# EAGLE design 原理图 (EAGLE 6.4)
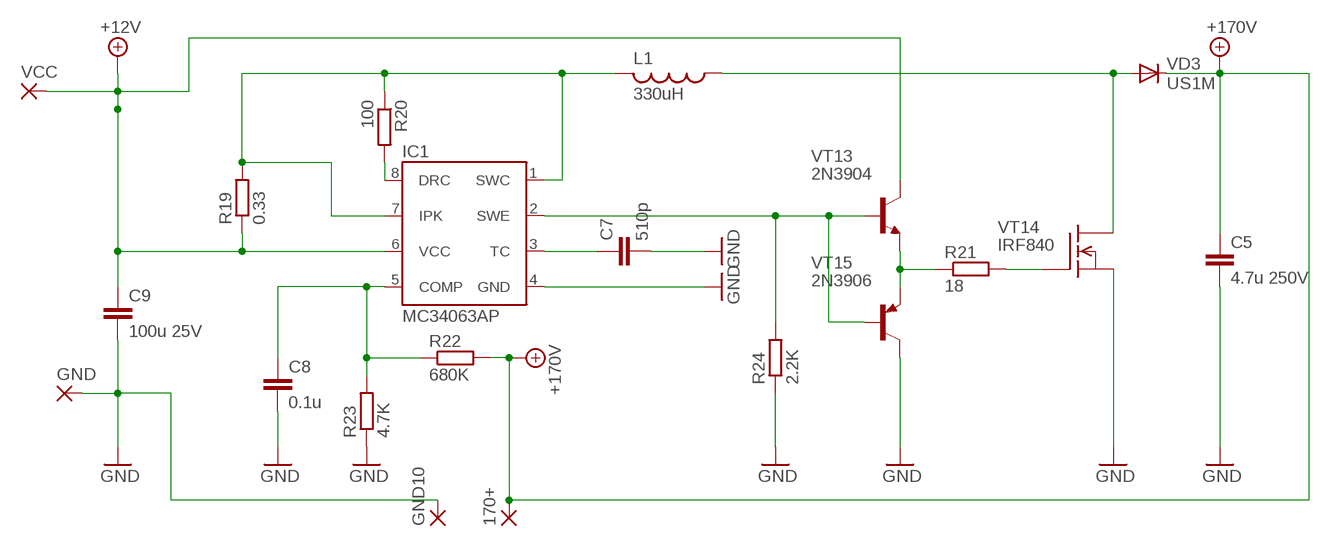
[diagram p0: schematic, sheet 1]

## Parts
170+  2,54/0,8  [2,54/0,8]
C5  4.7u 250V  C-EU025-030X050  [C025-030X050]
C7  510p  C-EU025-030X050  [C025-030X050]
C8  0.1u  C-EU025-030X050  [C025-030X050]
C9  100u 25V  C-EU025-030X050  [C025-030X050]
GND  2,54/0,8  [2,54/0,8]
GND10  2,54/0,8  [2,54/0,8]
IC1  MC34063AP  [DIL-08]
L1  330uH  L-US0204/5  [0204/5]
R19  0.33  R-EU_0204/5  [0204/5]
R20  100  R-EU_0204/5  [0204/5]
R21  18  R-EU_0204/5  [0204/5]
R22  680K  R-EU_0204/5  [0204/5]
R23  4.7K  R-EU_0204/5  [0204/5]
R24  2.2K  R-EU_0204/5  [0204/5]
VCC  2,54/0,8  [2,54/0,8]
VD3  US1M  1N4004  [DO41-10]
VT13  2N3904  [TO92]
VT14  IRF840  [TO220]
VT15  2N3906  [TO92]

## Nets
+12V: C9.1 IC1.6(VCC) R19.1 VCC.1(P) VT13.1(C)
+UB: 170+.1(P) C5.1 R22.2 VD3.C ; supply symbol labelled +170V
GND: C5.2 C7.2 C8.2 C9.2 GND10.1(P) GND.1(P) IC1.4(GND) R23.1 R24.1 VT14.3(S) VT15.1(C)
N$1: IC1.8(DRC) R20.2
N$2: C7.1 IC1.3(TC)
N$3: C8.1 IC1.5(COMP) R22.1 R23.2
N$4: L1.1 VD3.A VT14.2(D)
N$5: IC1.1(SWC) IC1.7(IPK) L1.2 R19.2 R20.1
N$6: IC1.2(SWE) R24.2 VT13.2(B) VT15.2(B)
N$7: R21.1 VT13.3(E) VT15.3(E)
N$8: R21.2 VT14.1(G)

## Library data of the parts
170+ GND GND10 VCC = wirepad:2,54/0,8: THROUGH-HOLE PAD
C5 C7-C9 = rcl:C-EU: CAPACITOR, European symbol
IC1 = v-reg-3:MC34063A: 1.5A Step-Up/Down/Inverting Switching Regulator NPN Darlington Switch, Vin 3V to 40V, Current Limiter Input, adjustable Frequency up to 100kHz
L1 = rcl:L-US: INDUCTOR, American symbol
R19-R24 = rcl:R-EU_: RESISTOR, European symbol
VD3 = diode:1N4004: DIODE general purpose rectifier, 1 A
VT13 = transistor:2N3904: NPN TRANSISTOR
VT14 = transistor-fet:IRF840: N-Channel Enhancement MOSFET (HEXFET); 500V; 8A; 0,85Ohm
VT15 = transistor-pnp:2N3906: PNP Transistor

## Board
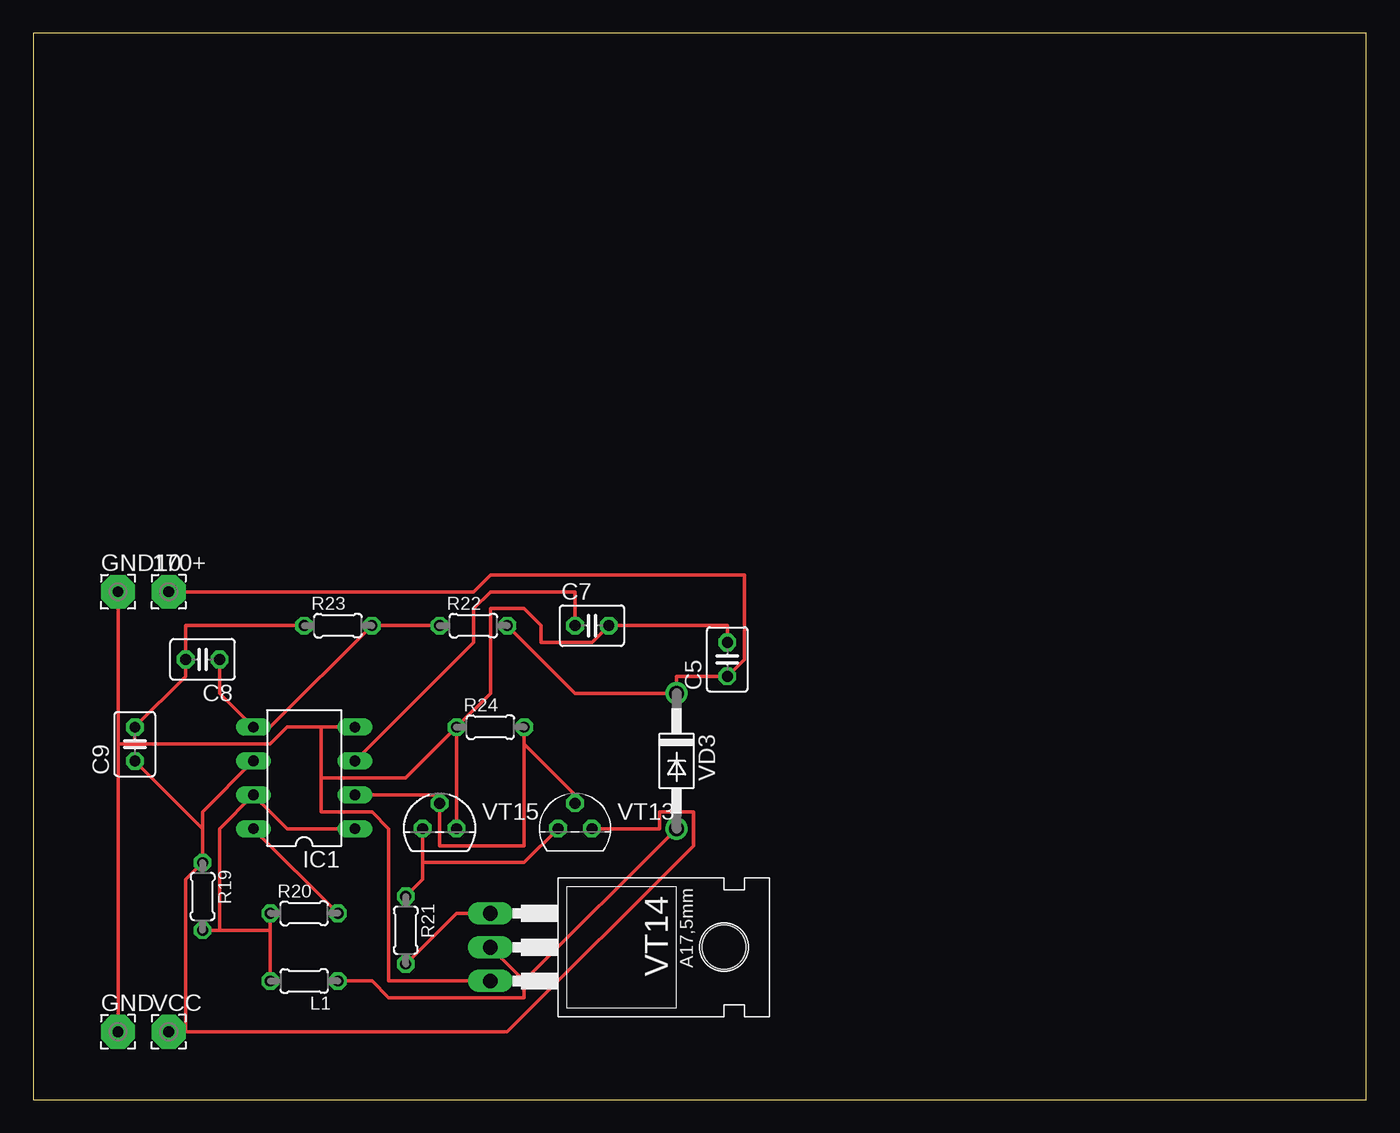
[diagram p1: board, top side]

Size 100 x 80 mm. Coordinates in mm from the lower left corner, seen from the top.
Outline: 0,0 100,0 100,80 0,80 0,0
Copper layers (1*16): Top 0.035mm / dielectric 1.5mm / Bottom 0.035mm
Design rules "default": minimum track width 10mil, minimum drill 24mil, track to track 8mil, track to pad 8mil, pad to pad 8mil, via to via 8mil, smd to smd 8mil, copper to edge 40mil, drill to drill 8mil, minimum pad ring 10mil, minimum via ring 8mil, stop-mask expansion 4mil, vias tented up to drill 0mil, thermal gap 10mil

### Footprints (pad centres in the part's own frame; a part is rotated, then mirrored left to right if it is on the bottom)
2,54/0,8 = drill 0.813 pad 2.54 octagon: 1 0,0
C025-030X050 = drill 0.813 octagon: 1 -1.27,0; 2 1.27,0
DIL-08 = drill 0.813 long: 1 -3.81,-3.81; 2 -1.27,-3.81; 3 1.27,-3.81; 4 3.81,-3.81; 5 3.81,3.81; 6 1.27,3.81; 7 -1.27,3.81; 8 -3.81,3.81
0204/5 = drill 0.813 octagon: 1 -2.54,0; 2 2.54,0
DO41-10 = drill 1.118: A 5.08,0; C -5.08,0
TO92 = drill 0.813 octagon: 1 1.27,0; 2 0,1.905; 3 -1.27,0
TO220 = drill 1.118 long: 1 -2.54,-6.35; 2 0,-6.35; 3 2.54,-6.35 | hole 3.302: 0,11.176

### Placement (x,y rotation side)
170+  10.16,38.1 0 top
C5  52.07,33.02 90 top
C7  41.91,35.56 0 top
C8  12.7,33.02 180 top
C9  7.62,26.67 90 top
GND  6.35,5.08 0 top
GND10  6.35,38.1 0 top
IC1  20.32,24.13 90 top
L1  20.32,8.89 180 top
R19  12.7,15.24 270 top
R20  20.32,13.97 0 top
R21  27.94,12.7 270 top
R22  33.02,35.56 0 top
R23  22.86,35.56 0 top
R24  34.29,27.94 0 top
VCC  10.16,5.08 0 top
VD3  48.26,25.4 270 top
VT13  40.64,20.32 0 top
VT14  40.64,11.43 270 top
VT15  30.48,20.32 0 top

### Tracks (layer width: path | path; a pad name or v marks a point on that pad's centre or on a via)
+12V
  Top 0.254: IC1.6 12.7,21.59 12.7,20.32 | 12.7,20.32 R19.1 11.43,16.51 11.43,5.08 | 12.7,20.32 C9.1 | VT13.1 46.99,20.32 46.99,21.59 49.53,21.59 49.53,19.05 35.56,5.08 11.43,5.08 | VCC.1 11.43,5.08
+UB
  Top 0.254: R22.2 40.64,30.48 VD3.C 48.26,31.75 C5.1 53.34,33.02 53.34,39.37 34.29,39.37 33.02,38.1 170+.1
GND
  Top 0.254: C5.2 52.07,35.56 C7.2 41.91,34.29 38.1,34.29 38.1,35.56 36.83,36.83 34.29,36.83 34.29,30.48 R24.1 | GND10.1 6.35,26.67 | 6.35,26.67 GND.1 | R24.1 VT15.1 | 21.59,27.94 19.05,27.94 17.78,26.67 7.62,26.67 | 21.59,27.94 IC1.4 | 7.62,26.67 C9.2 11.43,31.75 C8.2 11.43,35.56 R23.1 | VT14.3 26.67,8.89 26.67,20.32 25.4,21.59 21.59,21.59 21.59,24.13 | 21.59,27.94 21.59,24.13 | R24.1 27.94,24.13 21.59,24.13 | 7.62,26.67 6.35,26.67
N$1
  Top 0.254: R20.2 IC1.8
N$2
  Top 0.254: IC1.3 33.02,34.29 33.02,36.83 34.29,38.1 40.64,38.1 C7.1
N$3
  Top 0.254: R22.1 R23.2 17.78,27.94 IC1.5 13.97,30.48 C8.1
N$4
  Top 0.254: L1.1 25.4,8.89 26.67,7.62 36.83,7.62 36.83,8.89 | VT14.2 36.83,8.89 | 36.83,8.89 VD3.A
N$5
  Top 0.254: 17.78,12.7 13.97,12.7 | 13.97,12.7 R19.2 | R20.1 17.78,12.7 | 13.97,12.7 13.97,20.32 IC1.7 19.05,20.32 IC1.1 | 17.78,12.7 L1.2
N$6
  Top 0.254: IC1.2 30.48,22.86 VT15.2 30.48,19.05 36.83,19.05 36.83,26.67 | 36.83,26.67 40.64,22.86 VT13.2 | R24.2 36.83,26.67
N$7
  Top 0.254: R21.1 29.21,16.51 29.21,17.78 | VT15.3 29.21,17.78 | VT13.3 36.83,17.78 29.21,17.78
N$8
  Top 0.254: R21.2 31.75,13.97 VT14.1